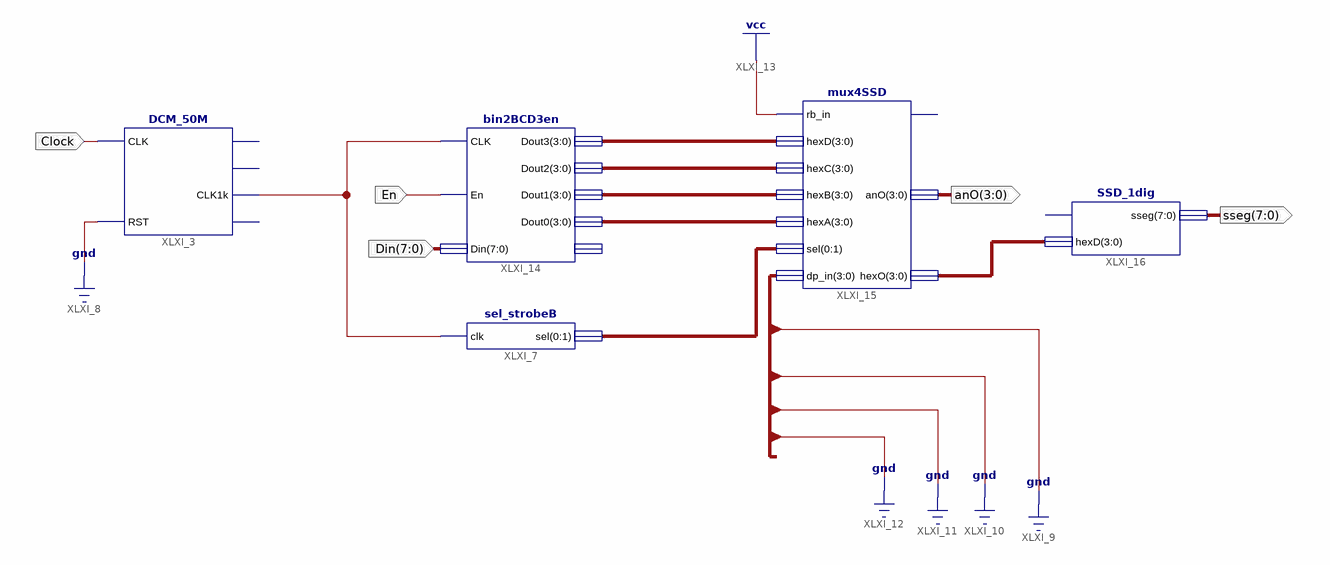
[diagram p0: schematic sheet 1]
// Xilinx ISE schematic lab6_experimen3.sch (spartan3e) as structural Verilog: 5 symbols, 5 ports
module lab6_experimen3 (
  input  En,
  input  [7:0] Din,
  input  Clock,
  output [7:0] sseg,
  output [3:0] anO
);

  wire XLXN_31;
  wire [1:0] XLXN_15;
  wire [3:0] XLXN_6, XLXN_7, XLXN_8, XLXN_9, XLXN_13;

  DCM_50M XLXI_3 (.CLK(Clock), .RST(1'b0), .CLK1k(XLXN_31));  // open: CLK1M, CLK10k, CLK1
  sel_strobeB XLXI_7 (.clk(XLXN_31), .sel({XLXN_15[0], XLXN_15[1]}));
  bin2BCD3en XLXI_14 (
    .CLK(XLXN_31), .En(En), .Din(Din), .Dout3(XLXN_9), .Dout2(XLXN_8), .Dout1(XLXN_7), .Dout0(XLXN_6));  // open: RBout
  mux4SSD XLXI_15 (
    .rb_in(1'b1), .hexD(XLXN_9), .hexC(XLXN_8), .hexB(XLXN_7), .hexA(XLXN_6), .sel({XLXN_15[0], XLXN_15[1]}),
    .dp_in(4'b0000), .anO(anO), .hexO(XLXN_13));  // open: dpO
  SSD_1dig XLXI_16 (.hexD(XLXN_13), .sseg(sseg));  // open: dp_in
endmodule
